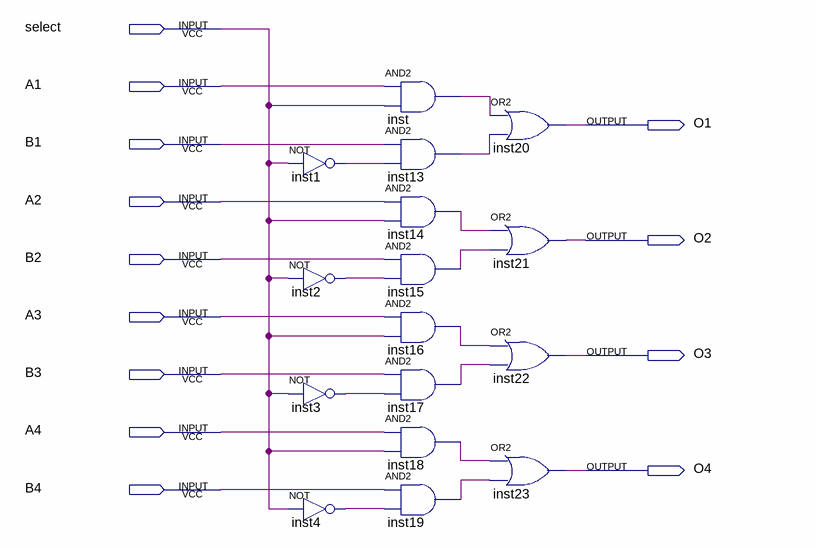
[diagram p0: schematic sheet]
// Quartus schematic MUX2_1_4bits.bdf as structural Verilog: 16 symbols, 13 pins
module MUX2_1_4bits (
  input  select,
  input  A1,
  input  B1,
  input  A2,
  input  B2,
  input  A3,
  input  B3,
  input  A4,
  input  B4,
  output O1,
  output O2,
  output O3,
  output O4
);

  wire inst1_out, inst2_out, inst3_out, inst4_out, inst13_out, inst14_out, inst15_out, inst16_out,
       inst17_out, inst18_out, inst19_out, inst_out;

  not inst1 (inst1_out, select);
  not inst2 (inst2_out, select);
  not inst3 (inst3_out, select);
  not inst4 (inst4_out, select);
  and inst (inst_out, A1, select);
  and inst13 (inst13_out, B1, inst1_out);
  and inst14 (inst14_out, A2, select);
  and inst15 (inst15_out, B2, inst2_out);
  and inst16 (inst16_out, A3, select);
  and inst17 (inst17_out, B3, inst3_out);
  and inst18 (inst18_out, A4, select);
  and inst19 (inst19_out, B4, inst4_out);
  or inst20 (O1, inst_out, inst13_out);
  or inst21 (O2, inst14_out, inst15_out);
  or inst22 (O3, inst16_out, inst17_out);
  or inst23 (O4, inst18_out, inst19_out);
endmodule
